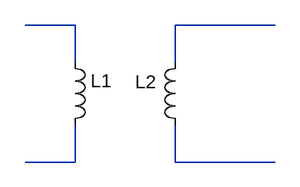
[diagram p0: schematic Draft3.asc]
Draft3.asc, the LTspice schematic file:
Version 4
SHEET 1 880 680
WIRE 112 64 48 64
WIRE 368 64 240 64
WIRE 112 112 112 64
WIRE 240 112 240 64
WIRE 112 240 112 192
WIRE 112 240 48 240
WIRE 240 240 240 192
WIRE 368 240 240 240
SYMBOL ind 96 96 R0
SYMATTR InstName L1
SYMATTR Value ""
SYMBOL ind 256 208 R180
WINDOW 0 40 71 Left 2
WINDOW 3 36 40 Left 2
SYMATTR InstName L2
SYMATTR Value ""

The netlist it stands for:
* Draft3.asc
L1 N001 N003
L2 N004 N002
.backanno
.end